# Altium schematic sheet OUT_MOT.SchDoc
size A4; SheetNumber: 3
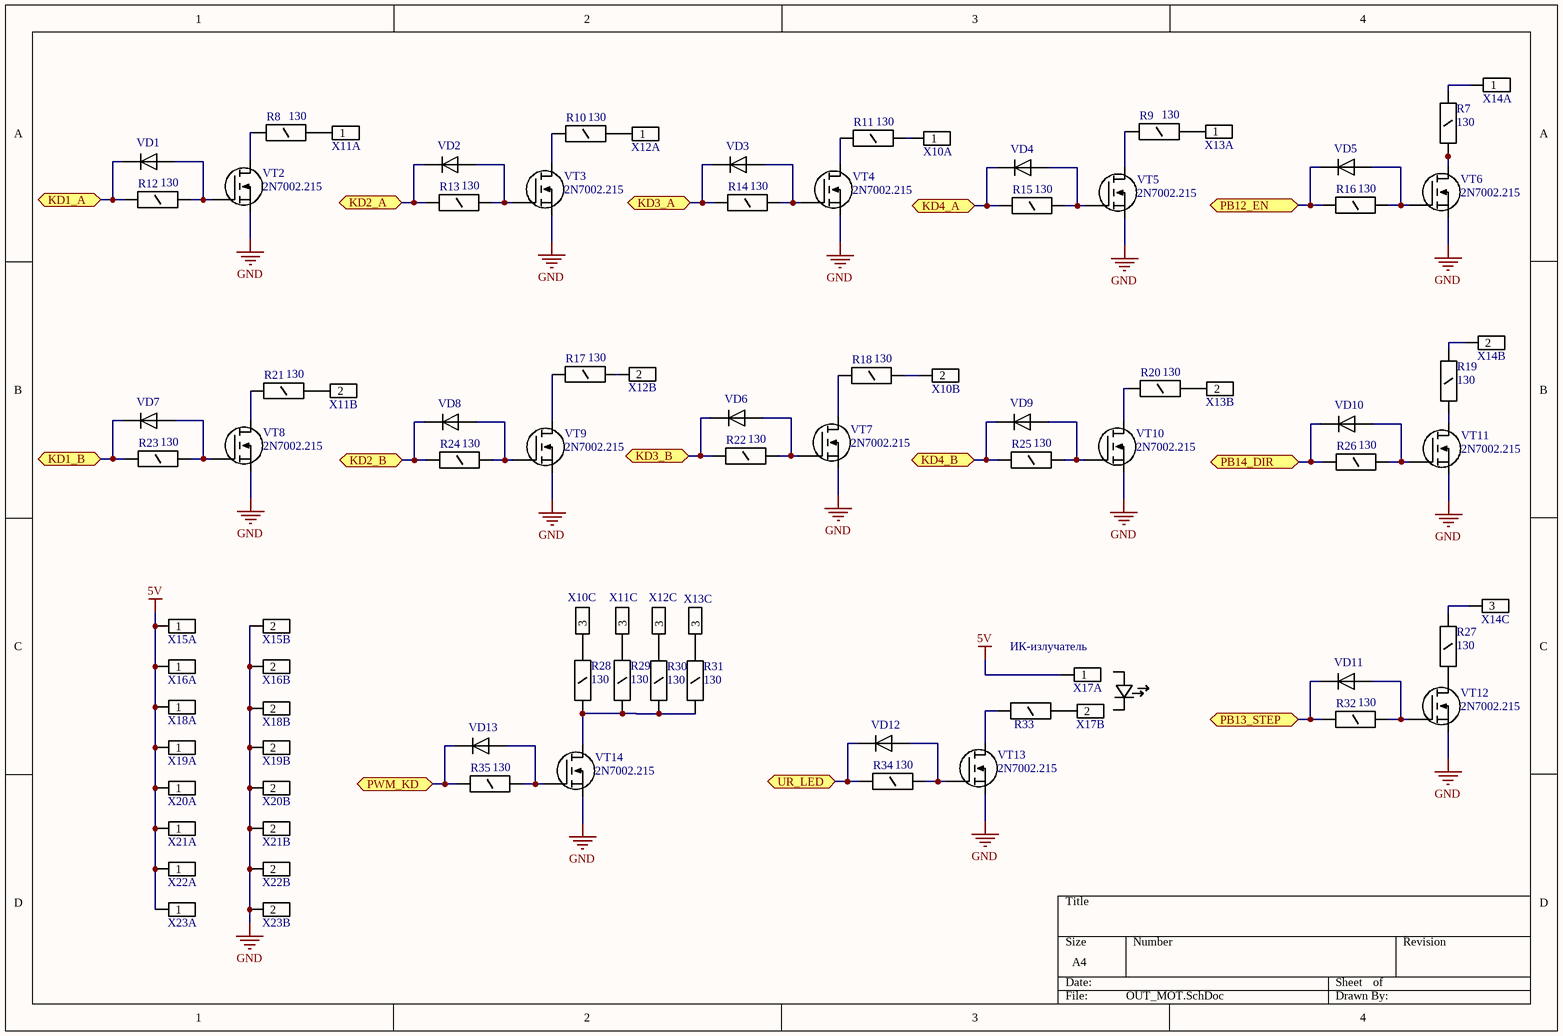
[diagram p0: OUT_MOT.SchDoc]

## Parts
R7  130  [R_1206]
R8  130  [R_1206]
R9  130  [R_1206]
R10  130  [R_1206]
R11  130  [R_1206]
R12  130  [R_1206]
R13  130  [R_1206]
R14  130  [R_1206]
R15  130  [R_1206]
R16  130  [R_1206]
R17  130  [R_1206]
R18  130  [R_1206]
R19  130  [R_1206]
R20  130  [R_1206]
R21  130  [R_1206]
R22  130  [R_1206]
R23  130  [R_1206]
R24  130  [R_1206]
R25  130  [R_1206]
R26  130  [R_1206]
R27  130  [R_1206]
R28  130  [R_1206]
R29  130  [R_1206]
R30  130  [R_1206]
R31  130  [R_1206]
R32  130  [R_1206]
R33  0  [R_1206]  (value not drawn)
R34  130  [R_1206]
R35  130  [R_1206]
VD1  MBR0520LT1G  [SOD-123]  (value not drawn)
VD2  MBR0520LT1G  [SOD-123]  (value not drawn)
VD3  MBR0520LT1G  [SOD-123]  (value not drawn)
VD4  MBR0520LT1G  [SOD-123]  (value not drawn)
VD5  MBR0520LT1G  [SOD-123]  (value not drawn)
VD6  MBR0520LT1G  [SOD-123]  (value not drawn)
VD7  MBR0520LT1G  [SOD-123]  (value not drawn)
VD8  MBR0520LT1G  [SOD-123]  (value not drawn)
VD9  MBR0520LT1G  [SOD-123]  (value not drawn)
VD10  MBR0520LT1G  [SOD-123]  (value not drawn)
VD11  MBR0520LT1G  [SOD-123]  (value not drawn)
VD12  MBR0520LT1G  [SOD-123]  (value not drawn)
VD13  MBR0520LT1G  [SOD-123]  (value not drawn)
VT2  2N7002.215  [SOT23]
VT3  2N7002.215  [SOT23]
VT4  2N7002.215  [SOT23]
VT5  2N7002.215  [SOT23]
VT6  2N7002.215  [SOT23]
VT7  2N7002.215  [SOT23]
VT8  2N7002.215  [SOT23]
VT9  2N7002.215  [SOT23]
VT10  2N7002.215  [SOT23]
VT11  2N7002.215  [SOT23]
VT12  2N7002.215  [SOT23]
VT13  2N7002.215  [SOT23]
VT14  2N7002.215  [SOT23]
X10  300-031-12  [300-031-12]  (value not drawn)  (parts A,B,C of 3)
X11  300-031-12  [300-031-12]  (value not drawn)  (parts A,B,C of 3)
X12  300-031-12  [300-031-12]  (value not drawn)  (parts A,B,C of 3)
X13  300-031-12  [300-031-12]  (value not drawn)  (parts A,B,C of 3)
X14  300-031-12  [300-031-12]  (value not drawn)  (parts A,B,C of 3)
X15  DG508V-02  [DG508V-02]  (value not drawn)  (parts A,B of 2)
X16  DG508V-02  [DG508V-02]  (value not drawn)  (parts A,B of 2)
X17  DG508V-02  [DG508V-02]  (value not drawn)  (parts A,B of 2)
X18  DG508V-02  [DG508V-02]  (value not drawn)  (parts A,B of 2)
X19  DG508V-02  [DG508V-02]  (value not drawn)  (parts A,B of 2)
X20  DG508V-02  [DG508V-02]  (value not drawn)  (parts A,B of 2)
X21  DG508V-02  [DG508V-02]  (value not drawn)  (parts A,B of 2)
X22  DG508V-02  [DG508V-02]  (value not drawn)  (parts A,B of 2)
X23  DG508V-02  [DG508V-02]  (value not drawn)  (parts A,B of 2)

## Ports
KD1_A, KD1_B, KD2_A, KD2_B, KD3_A, KD3_B, KD4_A, KD4_B, PB12_EN, PB13_STEP, PB14_DIR, PWM_KD, UR_LED

## Nets
5V: X15.1 X16.1 X17.1 X18.1 X19.1 X20.1 X21.1 X22.1 X23.1
GND: VT2.2(S) VT3.2(S) VT4.2(S) VT5.2(S) VT6.2(S) VT7.2(S) VT8.2(S) VT9.2(S) VT10.2(S) VT11.2(S) VT12.2(S) VT13.2(S) VT14.2(S) X15.2 X16.2 X18.2 X19.2 X20.2 X21.2 X22.2 X23.2
KD1_A: R12.1 VD1.K ; port KD1_A
KD1_B: R23.1 VD7.K ; port KD1_B
KD2_A: R13.1 VD2.K ; port KD2_A
KD2_B: R24.1 VD8.K ; port KD2_B
KD3_A: R14.1 VD3.K ; port KD3_A
KD3_B: R22.1 VD6.K ; port KD3_B
KD4_A: R15.1 VD4.K ; port KD4_A
KD4_B: R25.1 VD9.K ; port KD4_B
PB12_EN: R16.1 VD5.K ; port PB12_EN
PB13_STEP: R32.1 VD11.K ; port PB13_STEP
PB14_DIR: R26.1 VD10.K ; port PB14_DIR
PWM_KD: R35.1 VD13.K ; port PWM_KD
UR_LED: R34.1 VD12.K ; port UR_LED
NetR7_1: R7.1 VT6.3(D)
NetR7_2: R7.2 X14.1
NetR8_1: R8.1 VT2.3(D)
NetR8_2: R8.2 X11.1
NetR9_1: R9.1 VT5.3(D)
NetR9_2: R9.2 X13.1
NetR10_1: R10.1 VT3.3(D)
NetR10_2: R10.2 X12.1
NetR11_1: R11.1 VT4.3(D)
NetR11_2: R11.2 X10.1
NetR12_2: R12.2 VD1.A VT2.1(G)
NetR13_2: R13.2 VD2.A VT3.1(G)
NetR14_2: R14.2 VD3.A VT4.1(G)
NetR15_2: R15.2 VD4.A VT5.1(G)
NetR16_2: R16.2 VD5.A VT6.1(G)
NetR17_1: R17.1 VT9.3(D)
NetR17_2: R17.2 X12.2
NetR18_1: R18.1 VT7.3(D)
NetR18_2: R18.2 X10.2
NetR19_1: R19.1 VT11.3(D)
NetR19_2: R19.2 X14.2
NetR20_1: R20.1 VT10.3(D)
NetR20_2: R20.2 X13.2
NetR21_1: R21.1 VT8.3(D)
NetR21_2: R21.2 X11.2
NetR22_2: R22.2 VD6.A VT7.1(G)
NetR23_2: R23.2 VD7.A VT8.1(G)
NetR24_2: R24.2 VD8.A VT9.1(G)
NetR25_2: R25.2 VD9.A VT10.1(G)
NetR26_2: R26.2 VD10.A VT11.1(G)
NetR27_1: R27.1 VT12.3(D)
NetR27_2: R27.2 X14.3
NetR28_1: R28.1 R29.1 R30.1 R31.1 VT14.3(D)
NetR28_2: R28.2 X10.3
NetR29_2: R29.2 X11.3
NetR30_2: R30.2 X12.3
NetR31_2: R31.2 X13.3
NetR32_2: R32.2 VD11.A VT12.1(G)
NetR33_1: R33.1 X17.2
NetR33_2: R33.2 VT13.3(D)
NetR34_2: R34.2 VD12.A VT13.1(G)
NetR35_2: R35.2 VD13.A VT14.1(G)

## Notes on the sheet
- (near X17) ИК-излучатель

## Library data of the parts
R7-R35 = Резистор 1206: 0,25 Вт; Name: 1206; Power: 0.25 Вт; Tolerance: 5%; Voltage: 200В; Type: Резистор ЧИП; Mounting: SMD
  R7-R32 R34 R35: Value: 130
  R33: Value: 0
VD1-VD13 = SMA400*: диод, SMD; Max current: 1 А; Drop voltage: 1.1 В; Name: MBR0520LT1G; Mounting: SMD; Temperature: -65 .. +175; Max voltage: ?
VT2-VT14 = 2N7002.215: MOSFET, SOT23; Type: МОП, N-канал; Package: SOT23; Name: 2N7002.215; Mounting: SMD
X10-X14 = 300-031-12: клеммник винтовой 3к.,5мм; Analog: DG300-5.0-03P; Name: 300-031-12; Type: шаг 5 мм; Mounting: в отверстие
X15-X23 = DG508V-02: клеммник винтовой 2к.,5.08мм; Analog: MKDS 2/3; Name: DG508V-02; Type: шаг 5,08 мм; Mounting: в отверстие